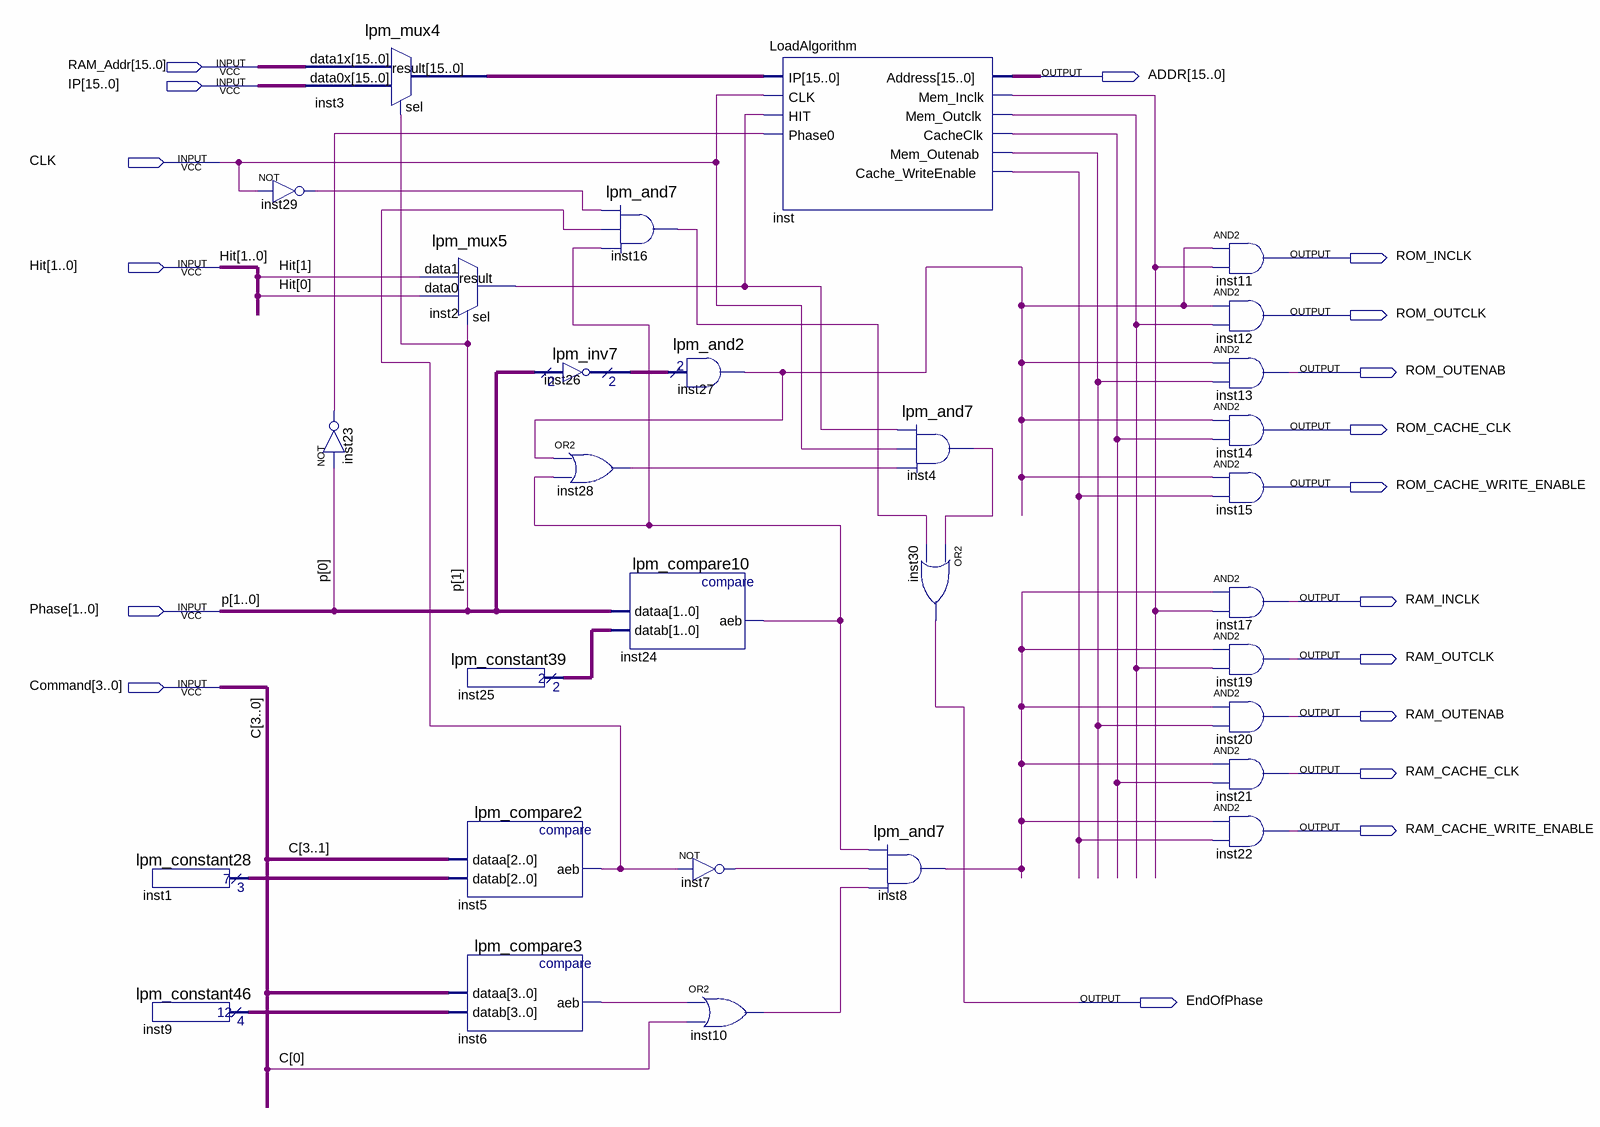
[diagram p0: schematic sheet]
// Quartus schematic LoadToCacheAlgorithm.bdf as structural Verilog: 30 symbols, 18 pins
module LoadToCacheAlgorithm (
  input  [15:0] RAM_Addr,
  input  [15:0] IP,
  input  CLK,
  input  [1:0] Hit,
  input  [1:0] Phase,
  input  [3:0] Command,
  output [15:0] ADDR,
  output ROM_INCLK,
  output ROM_OUTCLK,
  output ROM_OUTENAB,
  output ROM_CACHE_CLK,
  output ROM_CACHE_WRITE_ENABLE,
  output RAM_INCLK,
  output RAM_OUTCLK,
  output RAM_OUTENAB,
  output RAM_CACHE_CLK,
  output RAM_CACHE_WRITE_ENABLE,
  output EndOfPhase
);

  wire inst2_result, inst4_result, inst5_aeb, inst6_aeb, inst7_out, inst8_result, inst10_out, inst16_result,
       inst23_out, inst24_aeb, inst27_result, inst28_out, inst29_out, inst_cache_writeenable, inst_cacheclk,
       inst_mem_inclk, inst_mem_outclk, inst_mem_outenab;
  wire [1:0] inst25_result, inst26_result;
  wire [2:0] inst1_result;
  wire [3:0] inst9_result;
  wire [15:0] inst3_result;

  lpm_constant28 inst1 (.result(inst1_result));
  lpm_constant46 inst9 (.result(inst9_result));
  not inst29 (inst29_out, CLK);
  lpm_mux4 inst3 (.data1x(RAM_Addr), .data0x(IP), .sel(Phase[1]), .result(inst3_result));
  not inst23 (inst23_out, Phase[0]);
  lpm_mux5 inst2 (.data1(Hit[1]), .data0(Hit[0]), .sel(Phase[1]), .result(inst2_result));
  lpm_constant39 inst25 (.result(inst25_result));
  lpm_compare2 inst5 (.dataa(Command[3:1]), .datab(inst1_result), .aeb(inst5_aeb));
  lpm_compare3 inst6 (.dataa(Command), .datab(inst9_result), .aeb(inst6_aeb));
  lpm_inv7 inst26 (.data(Phase), .result(inst26_result));
  or inst28 (inst28_out, inst27_result, inst24_aeb);
  lpm_and7 inst16 (.data0(inst29_out), .data1(inst5_aeb), .data2(inst24_aeb), .result(inst16_result));
  lpm_and2 inst27 (.data(inst26_result), .result(inst27_result));
  lpm_compare10 inst24 (.dataa(Phase), .datab(inst25_result), .aeb(inst24_aeb));
  not inst7 (inst7_out, inst5_aeb);
  or inst10 (inst10_out, inst6_aeb, Command[0]);
  LoadAlgorithm inst (
    .IP(inst3_result), .CLK(CLK), .HIT(inst2_result), .Phase0(inst23_out), .Address(ADDR),
    .Mem_Inclk(inst_mem_inclk), .Mem_Outclk(inst_mem_outclk), .CacheClk(inst_cacheclk),
    .Mem_Outenab(inst_mem_outenab), .Cache_WriteEnable(inst_cache_writeenable));
  lpm_and7 inst4 (.data0(inst2_result), .data1(CLK), .data2(inst28_out), .result(inst4_result));
  lpm_and7 inst8 (.data0(inst24_aeb), .data1(inst7_out), .data2(inst10_out), .result(inst8_result));
  or inst30 (EndOfPhase, inst4_result, inst16_result);
  and inst11 (ROM_INCLK, inst27_result, inst_mem_inclk);
  and inst12 (ROM_OUTCLK, inst27_result, inst_mem_outclk);
  and inst13 (ROM_OUTENAB, inst27_result, inst_mem_outenab);
  and inst14 (ROM_CACHE_CLK, inst27_result, inst_cacheclk);
  and inst15 (ROM_CACHE_WRITE_ENABLE, inst27_result, inst_cache_writeenable);
  and inst17 (RAM_INCLK, inst8_result, inst_mem_inclk);
  and inst19 (RAM_OUTCLK, inst8_result, inst_mem_outclk);
  and inst20 (RAM_OUTENAB, inst8_result, inst_mem_outenab);
  and inst21 (RAM_CACHE_CLK, inst8_result, inst_cacheclk);
  and inst22 (RAM_CACHE_WRITE_ENABLE, inst8_result, inst_cache_writeenable);

  // Other names for the same wires on the sheet: C[3:0] = Command; p[1:0] = Phase
endmodule
